# Altium project MT32Pi_Main.PrjPcb
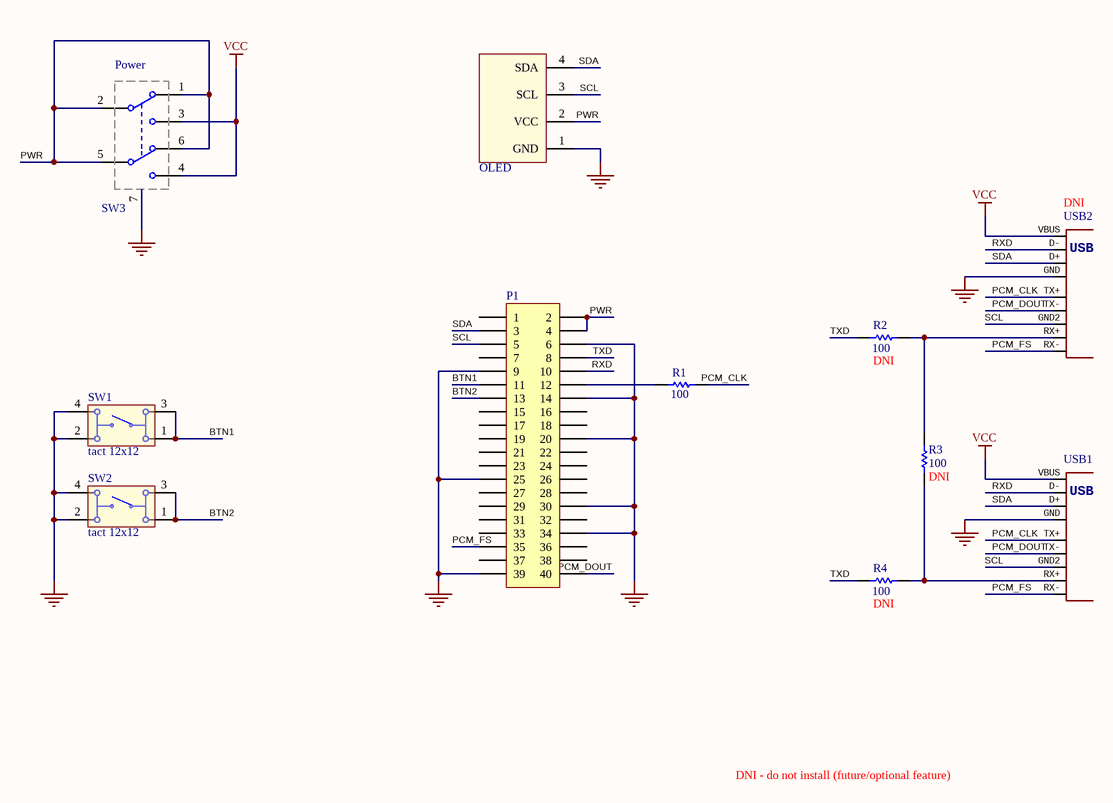
[diagram p0: MT32Pi_Main.SchDoc]
1 sheet, 11 parts. Net scope: global (net labels, ports and power ports of the same name join across sheets).
Board file: MT32Pi_Main.PcbDoc

## Sheet MT32Pi_Main.SchDoc: MT32-pi
size A4; DocumentNumber: 1; Revision: 2.1; SheetNumber: 1; SheetTotal: 1

### Parts
OLED  OLED  [OLED_128x64]  (value not drawn)
P1  Header 20X2  [HDR20x2]  (value not drawn)
R1  100  [R0805]
R2  100  [R0805 - DNI]
R3  100  [R0805 - DNI]
R4  100  [R0805 - DNI]
SW1  tact 12x12  [tact 12x12]
SW2  tact 12x12  [tact 12x12]
SW3  Power  [SW DPDT]
USB1  USBA30-PTH  [USB3-A-F-PTH]  (value not drawn)
USB2  USBA30-PTH  [USB3-A-F-PTH]  (value not drawn)

### Nets
GND: OLED.1(GND) P1.6 P1.9 P1.14 P1.20 P1.25 P1.30 P1.34 P1.39 SW1.2 SW1.4 SW2.2 SW2.4 SW3.7 USB1.GND USB2.GND
VCC: SW3.3(NO1) SW3.4(NO2) USB1.VBUS USB2.VBUS
BTN1: P1.11 SW1.1 SW1.3
BTN2: P1.13 SW2.1 SW2.3
PCM_CLK: R1.1 USB1.TX+ USB2.TX+
PCM_DOUT: P1.40 USB1.TX- USB2.TX-
PCM_FS: P1.35 USB1.RX- USB2.RX-
PWR: OLED.2(VCC) P1.2 P1.4 SW3.1(NC1) SW3.2(COMMON1) SW3.5(COMMON2) SW3.6(NC2)
RXD: P1.10 USB1.D- USB2.D-
SCL: OLED.3(SCL) P1.5 USB1.GND2 USB2.GND2
SDA: OLED.4(SDA) P1.3 USB1.D+ USB2.D+
TXD: P1.8 R2.1 R4.1
NetP1_12: P1.12 R1.2
NetR2_2: R2.2 R3.2 USB2.RX+
NetR3_1: R3.1 R4.2 USB1.RX+

Not connected (* = marked no-connect by the designer): P1 1 7 15 16 17 18 19 21 22 23 24 26 27 28 29 31 32 33 36 37 38

### Notes on the sheet
- (near USB2) DNI
- (near R2) DNI
- (near R3) DNI
- (near R4) DNI
- DNI - do not install (future/optional feature)
- Title
- Size:
- Date:
- A4
- Number:
- Time:
- Revision:
- Sheet
- of
- File:

### Library data of the parts
OLED = OLED: OLED 128x84 0.96"
P1 = Header 20X2: Header, 20-Pin, Dual row; LatestRevisionDate: 17-Jul-2002; LatestRevisionNote: Re-released for DXP Platform.; Publisher: Altium Limited
R1-R4 = ERJ6RS: Low Ohmic Value Thick Film Chip Resistor, 0.1 Ohm to 0.2 Ohm Range, 1%, 2% and 5% Tolerance, 0805 Size, 0.125 W; Published: 17-Dec-2003; LatestRevisionDate: 19-Mar-2004; LatestRevisionNote: Silkscreen size reduced.; PackageDocument: Mar-2003; PackageReference: 6-0805; Publisher: Altium Limited; Code_IPC: 2012 [0805]; ComponentLink1Description: Manufacturer Link; ComponentLink1URL: http://www.panasonic.com/industrial/components/resistive_products.htm; ComponentLink2Description: Datasheet; ComponentLink2URL: http://www.panasonic.com/industrial/components/pdf/AOA0000CE3.pdf
SW3 = SW DPDT
USB1 USB2 = USBA30-PTH: USB: USB